# EAGLE design sevenSeg4_atmega_5C_noGND (EAGLE 7.5.0)
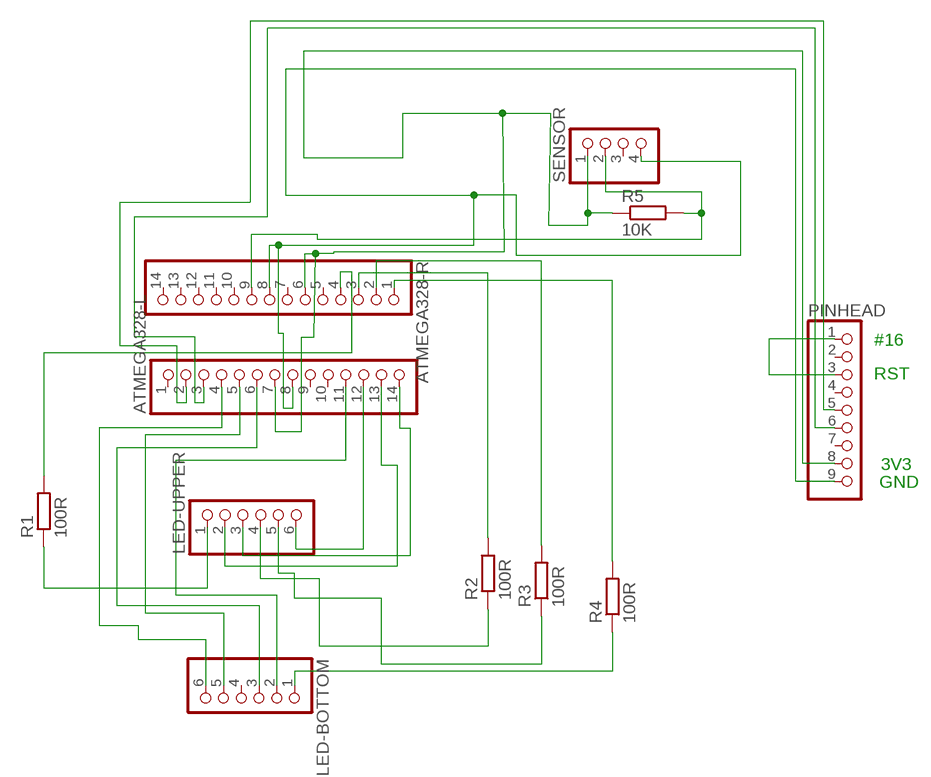
[diagram p0: schematic, sheet 1]

## Parts
ATMEGA328-L  PINHD-1X14  [1X14]
ATMEGA328-R  PINHD-1X14  [1X14]
LED-BOTTOM  PINHD-1X6  [1X06]
LED-UPPER  PINHD-1X6  [1X06]
PINHEAD  PINHD-1X9  [1X09]
R1  100R  R-EU_R0603  [R0603]
R2  100R  R-EU_R0603  [R0603]
R3  100R  R-EU_R0603  [R0603]
R4  100R  R-EU_R0603  [R0603]
R5  10K  R-EU_R0603  [R0603]
SENSOR  PINHD-1X4  [1X04]

## Nets
N$1: ATMEGA328-L.7 ATMEGA328-R.6 PINHEAD.8 R5.1 SENSOR.1
N$2: ATMEGA328-R.9 R5.2 SENSOR.2
N$4: ATMEGA328-L.3 PINHEAD.6
N$5: PINHEAD.1 PINHEAD.3
N$7: ATMEGA328-L.4 LED-BOTTOM.6
N$8: ATMEGA328-L.5 LED-BOTTOM.5
N$9: ATMEGA328-L.6 LED-BOTTOM.3
N$10: ATMEGA328-L.11 LED-BOTTOM.2
N$11: LED-UPPER.1 R1.1
N$12: ATMEGA328-L.12 LED-UPPER.6
N$13: ATMEGA328-R.3 R2.2
N$14: LED-UPPER.4 R2.1
N$15: ATMEGA328-L.13 LED-UPPER.2
N$16: ATMEGA328-L.14 LED-UPPER.3
N$17: ATMEGA328-R.4 R1.2
N$18: ATMEGA328-R.2 R3.2
N$19: LED-UPPER.5 R3.1
N$20: ATMEGA328-R.1 R4.2
N$21: LED-BOTTOM.1 R4.1
N$22: ATMEGA328-L.8 ATMEGA328-R.8 PINHEAD.9 SENSOR.4
N$24: ATMEGA328-L.2 PINHEAD.5
Unconnected: ATMEGA328-L.1 ATMEGA328-L.9 ATMEGA328-L.10 ATMEGA328-R.5 ATMEGA328-R.7 ATMEGA328-R.10 ATMEGA328-R.11 ATMEGA328-R.12 ATMEGA328-R.13 ATMEGA328-R.14 LED-BOTTOM.4 PINHEAD.2 PINHEAD.4 PINHEAD.7 SENSOR.3

## Notes on the sheet
- #16
- RST
- 3V3
- GND

## Library data of the parts
ATMEGA328-L ATMEGA328-R = pinhead:PINHD-1X14: PIN HEADER
LED-BOTTOM LED-UPPER = pinhead:PINHD-1X6: PIN HEADER
PINHEAD = pinhead:PINHD-1X9: PIN HEADER
R1-R5 = resistor:R-EU_: RESISTOR, European symbol
SENSOR = pinhead:PINHD-1X4: PIN HEADER

## Board
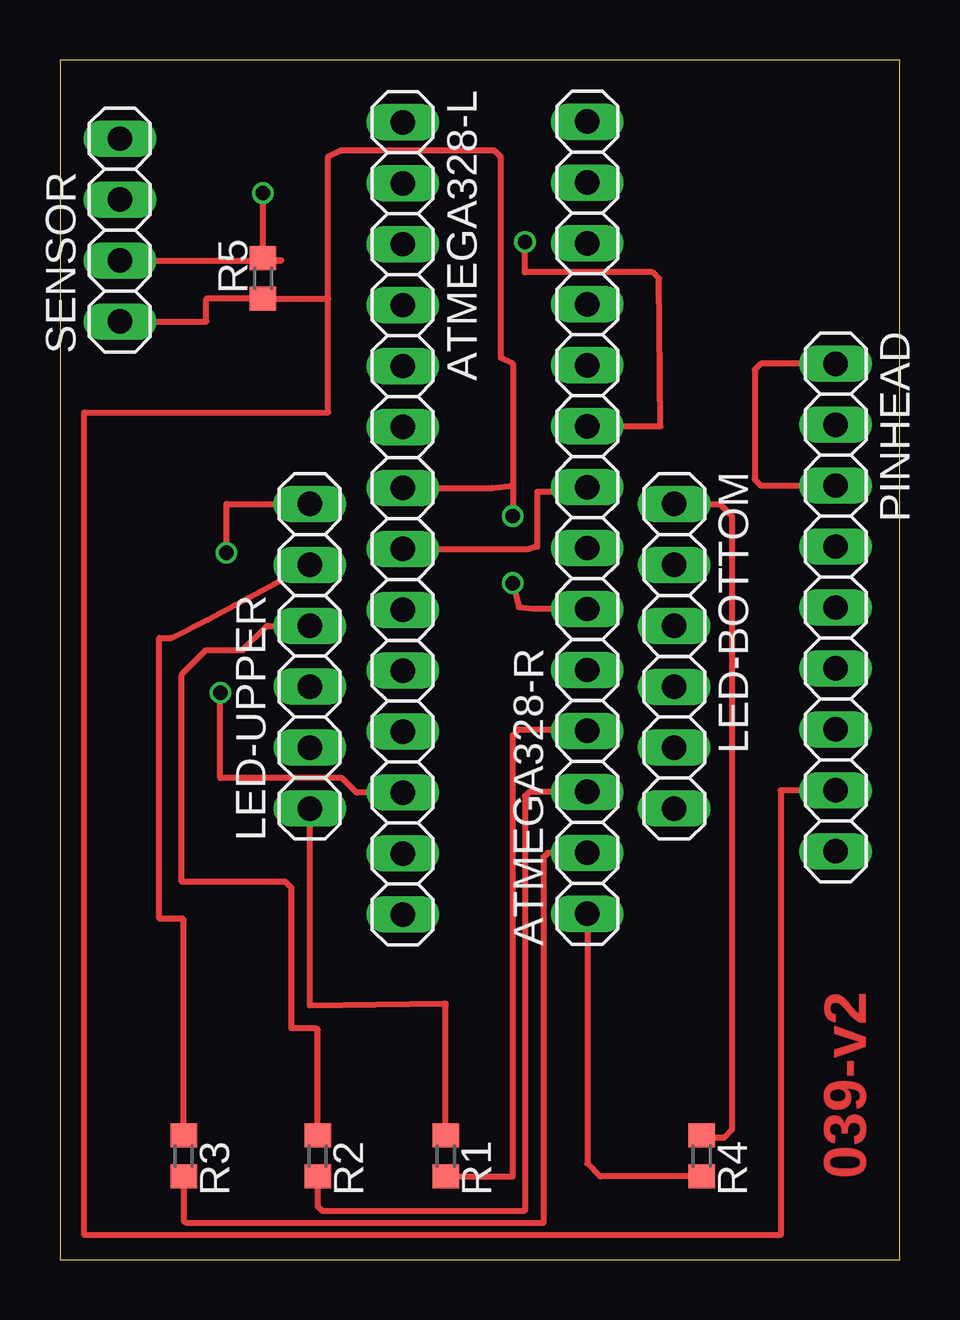
[diagram p1: board, top side]
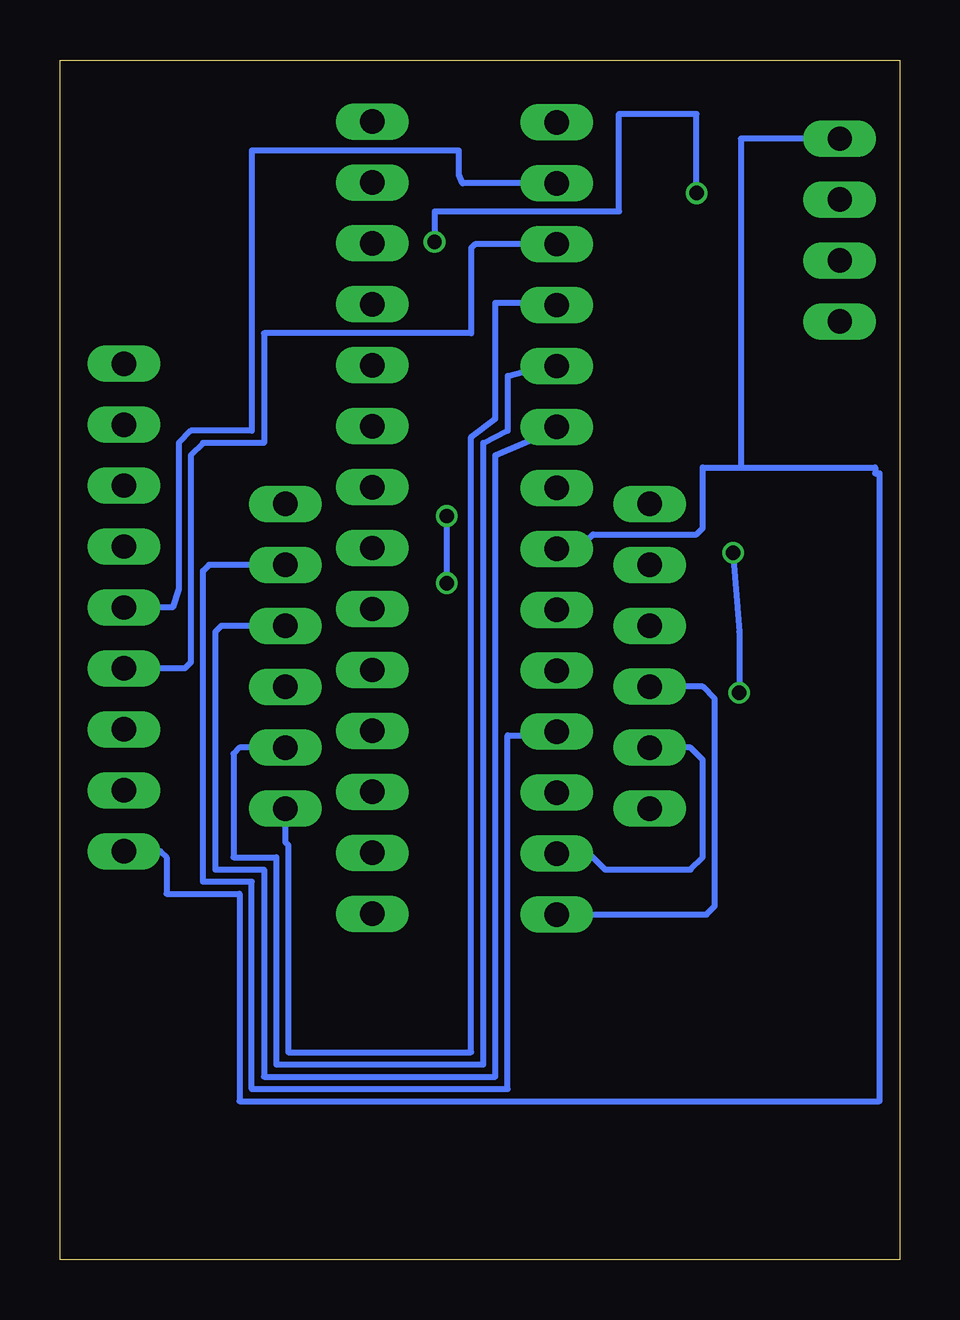
[diagram p2: board, bottom side, seen from below]

Size 35 x 50 mm. Coordinates in mm from the lower left corner, seen from the top.
Outline: 0,0 35,0 35,50 0,50 0,0
Copper layers (1*16): Top 0.035mm / dielectric 1.6mm / Bottom 0.035mm
Design rules "Elecrow_2-layer_PCB_eagle_rule": minimum track width 6mil, minimum drill 12mil, track to track 6mil, track to pad 6mil, pad to pad 6mil, via to via 8mil, smd to smd 0mil, copper to edge 20mil, drill to drill 10mil, minimum pad ring 6mil, minimum via ring 6mil, stop-mask expansion 0mil, vias tented up to drill 100mil, thermal gap 10mil

### Footprints (pad centres in the part's own frame; a part is rotated, then mirrored left to right if it is on the bottom)
1X14 = drill 1.016 long: 1 -16.51,0; 2 -13.97,0; 3 -11.43,0; 4 -8.89,0; 5 -6.35,0; 6 -3.81,0; 7 -1.27,0; 8 1.27,0; 9 3.81,0; 10 6.35,0; 11 8.89,0; 12 11.43,0; 13 13.97,0; 14 16.51,0
1X06 = drill 1.016 long: 1 -6.35,0; 2 -3.81,0; 3 -1.27,0; 4 1.27,0; 5 3.81,0; 6 6.35,0
1X09 = drill 1.016 long: 1 -10.16,0; 2 -7.62,0; 3 -5.08,0; 4 -2.54,0; 5 0,0; 6 2.54,0; 7 5.08,0; 8 7.62,0; 9 10.16,0
R0603 = smd 1 x 1.1: 1 -0.85,0; 2 0.85,0
1X04 = drill 1.016 long: 1 -3.81,0; 2 -1.27,0; 3 1.27,0; 4 3.81,0

### Placement (x,y rotation side)
ATMEGA328-L  14.29,30.89 270 top
ATMEGA328-R  21.99,30.93 90 top
LED-BOTTOM  25.61,25.14 270 top
LED-UPPER  10.41,25.15 90 top
PINHEAD  32.34,27.18 270 top
R1  16.08,4.32 270 top
R2  10.75,4.32 270 top
R3  5.16,4.32 270 top
R4  26.75,4.32 270 top
R5  8.46,40.89 90 top
SENSOR  2.49,42.91 90 top

### Tracks (layer width: path | path; a pad name or v marks a point on that pad's centre or on a via)
N$1  (via drill 0.6)
  Top 0.254: ATMEGA328-L.7 18.02,32.16 18.88,32.26 | ATMEGA328-R.6 19.7,27.11 19.13,27.18 v18.88,28.19 | 18.88,32.26 18.88,37.34 18.37,37.59 18.37,45.97 18.11,46.23 11.69,46.23 11.18,45.97 11.18,40.04 | PINHEAD.8 30.05,19.56 30.05,1.02 1.02,1.02 1.02,35.31 11.18,35.31 11.18,40.04 | 18.88,32.26 v18.88,30.99 | SENSOR.1 6.1,39.1 6.1,40.04 R5.1 11.18,40.04
  Bottom 0.254: v18.88,30.99 v18.88,28.19
N$2  (via drill 0.6)
  Top 0.254: ATMEGA328-R.9 25.03,34.73 24.97,40.89 24.72,41.15 19.38,41.15 v19.38,42.42 | v8.46,44.45 R5.2 9.22,41.64 SENSOR.2
  Bottom 0.254: v8.46,44.45 8.46,47.75 11.69,47.75 11.69,43.69 19.38,43.69 v19.38,42.42
N$4
  Bottom 0.254: ATMEGA328-L.3 17.7,42.32 17.86,42.16 17.86,38.61 26.5,38.61 26.5,34.04 29.04,34.04 29.54,33.53 29.54,24.89 29.8,24.64 PINHEAD.6
N$5
  Top 0.254: PINHEAD.1 29.21,37.34 28.96,37.08 28.96,32.51 29.21,32.26 PINHEAD.3
N$7
  Bottom 0.254: ATMEGA328-L.4 14.39,39.88 16.84,39.88 16.84,35.05 17.86,34.29 17.86,8.64 25.48,8.64 25.48,17.27 25.61,17.4 LED-BOTTOM.6
N$8
  Bottom 0.254: LED-BOTTOM.5 27.51,21.34 27.77,21.08 27.77,16.76 25.99,16.76 25.99,8.13 17.35,8.13 17.35,34.04 16.34,34.54 16.34,36.83 14.39,37.34 ATMEGA328-L.5
N$9
  Bottom 0.254: LED-BOTTOM.3 28.27,26.41 28.53,26.16 28.53,16.26 26.5,16.26 26.5,7.62 16.84,7.62 16.84,33.53 14.45,34.54 ATMEGA328-L.6
N$10
  Bottom 0.254: LED-BOTTOM.2 28.78,28.95 29.04,28.7 29.04,15.75 27,15.75 27,7.11 16.34,7.11 16.34,21.84 14.45,21.84 ATMEGA328-L.11
N$11
  Top 0.254: LED-UPPER.1 10.41,10.59 16,10.67 | 16,10.67 16.08,10.67 | R1.1 16.08,10.58 16,10.67
N$12  (via drill 0.6)
  Top 0.254: ATMEGA328-L.12 12.37,19.46 11.76,20.07 6.68,20.07 v6.68,23.62 | v6.94,29.46 6.94,31.5 LED-UPPER.6
  Bottom 0.254: v6.94,29.46 6.68,26.16 v6.68,23.62
N$13
  Top 0.254: ATMEGA328-R.3 19.57,19.5 19.38,19.3 19.38,2.03 10.93,2.03 10.75,2.21 R2.2
N$14
  Top 0.254: LED-UPPER.4 8.64,26.42 7.62,25.4 6.1,25.4 5.08,24.38 5.08,15.75 9.4,15.75 9.66,15.49 9.66,9.65 10.67,9.65 10.75,9.58 R2.1
N$15
  Bottom 0.254: ATMEGA328-L.13 12.94,16.92 12.27,16.26 8.72,16.26 8.21,16.76 8.21,20.83 8.72,21.34 LED-UPPER.2
N$16
  Bottom 0.254: ATMEGA328-L.14 8.05,14.38 7.7,14.73 7.7,23.37 8.21,23.88 LED-UPPER.3
N$17
  Top 0.254: ATMEGA328-R.4 21.92,22.1 19.13,22.1 18.88,21.84 18.88,3.47 R1.2
N$18
  Top 0.254: ATMEGA328-R.2 20.34,16.95 20.15,16.76 20.15,1.52 5.34,1.52 5.16,1.6 R3.2
N$19
  Top 0.254: LED-UPPER.5 6.18,26.67 4.65,25.91 4.14,25.91 4.14,14.22 5.08,14.22 5.16,14.15 R3.1
N$20
  Top 0.254: ATMEGA328-R.1 21.99,4 22.52,3.47 R4.2
N$21
  Top 0.254: LED-BOTTOM.1 27.51,31.5 28.02,30.99 28.02,5.41 27.69,5.08 26.84,5.08 R4.1
N$22
  Top 0.254: ATMEGA328-L.8 19.54,29.62 19.89,29.72 19.89,32 21.79,32 ATMEGA328-R.8
  Bottom 0.254: PINHEAD.9 30.81,17.02 30.56,16.76 30.56,15.24 27.51,15.24 27.51,6.6 0.84,6.6 0.84,32.77 1.02,32.77 1.02,33.02 6.61,33.02 | ATMEGA328-L.8 13.38,29.62 12.78,30.23 8.46,30.23 8.21,30.48 8.21,33.02 6.61,33.02 | SENSOR.4 6.61,46.72 | 6.61,46.72 6.61,46.74 | 6.61,46.72 6.61,33.02
N$24
  Bottom 0.254: ATMEGA328-L.2 18.21,44.86 18.37,45.21 18.37,46.23 27,46.23 27,34.54 29.54,34.54 30.05,34.04 30.05,27.94 30.31,27.18 PINHEAD.5

### Text on the board
Top: 039-v2